# Altium project TestBoard.PrjPcb
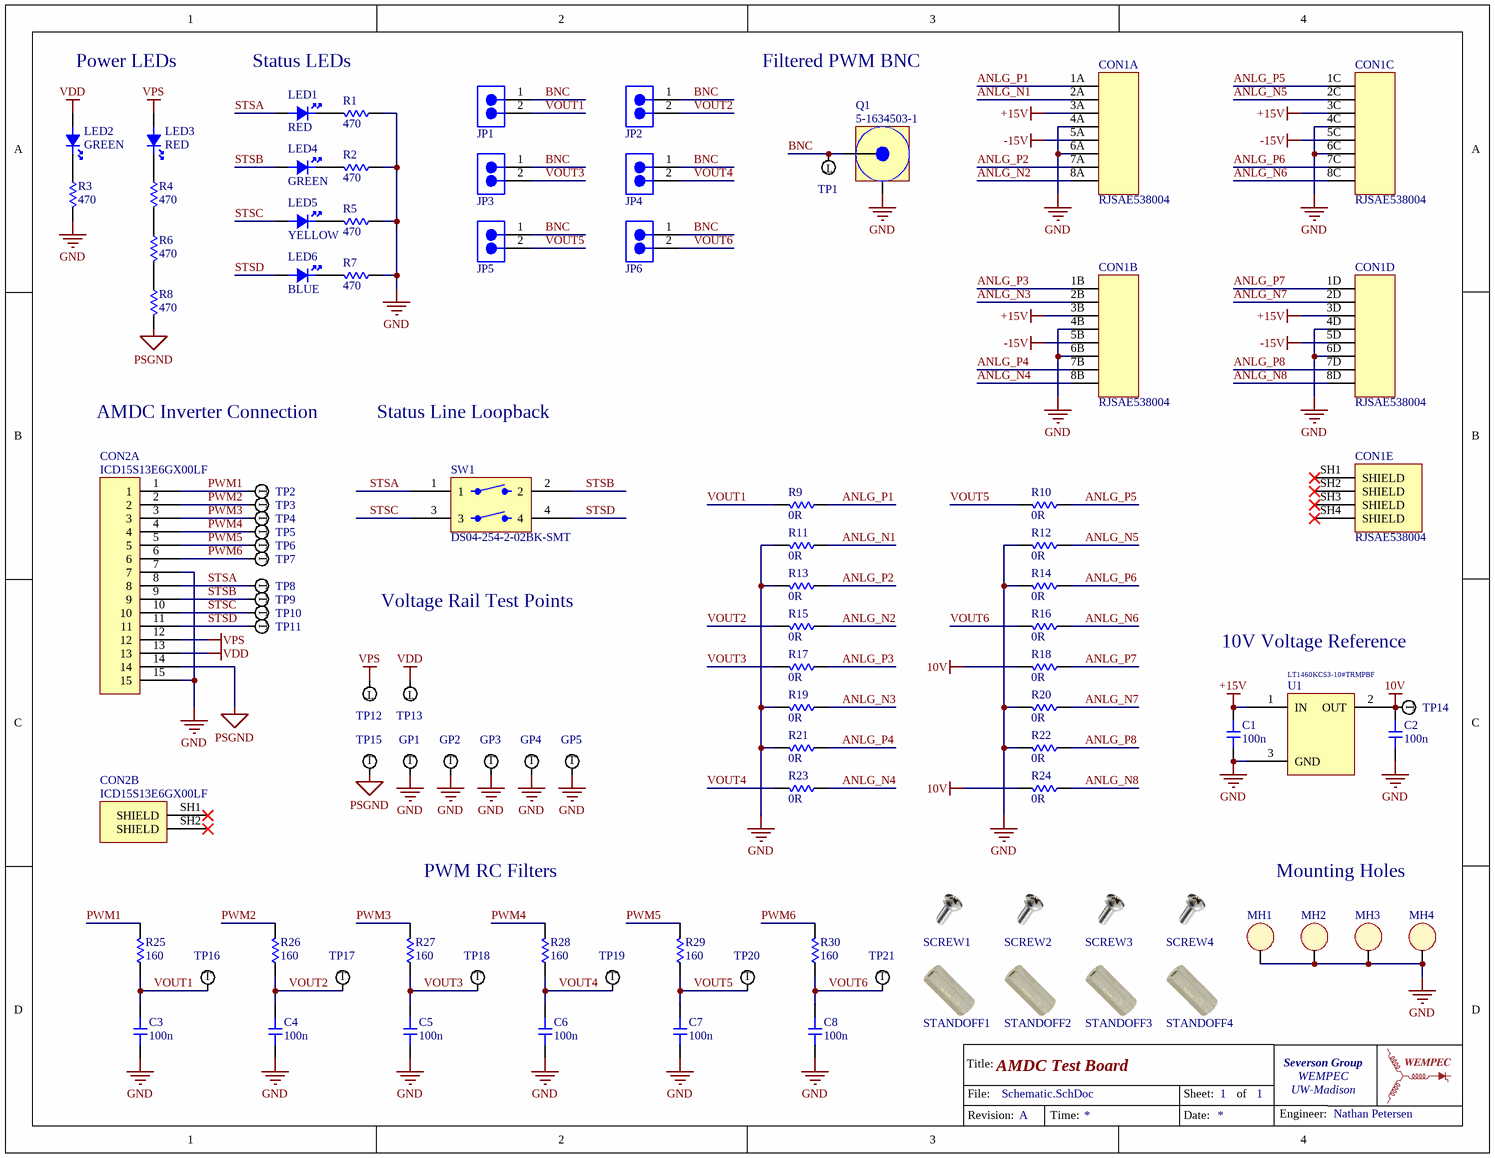
[diagram p0: Schematic.SchDoc]
ProjectGroup: Severson Group; ProjectOrganization: WEMPEC; ProjectRev: A; ProjectUniversity: UW-Madison
1 sheet, 94 parts. Net scope: global (net labels, ports and power ports of the same name join across sheets).
Board file: PCB.PcbDoc

## Sheet Schematic.SchDoc: AMDC Test Board
size Letter; Engineer: Nathan Petersen; SheetNumber: 1; SheetTotal: 1

### Parts
C1  value 100n  [0603-CAP]  (hidden comment: Capacitor)
C2  value 100n  [0603-CAP]  (hidden comment: Capacitor)
C3  value 100n  [0603-CAP]  (hidden comment: Capacitor)
C4  value 100n  [0603-CAP]  (hidden comment: Capacitor)
C5  value 100n  [0603-CAP]  (hidden comment: Capacitor)
C6  value 100n  [0603-CAP]  (hidden comment: Capacitor)
C7  value 100n  [0603-CAP]  (hidden comment: Capacitor)
C8  value 100n  [0603-CAP]  (hidden comment: Capacitor)
CON1  RJSAE538004  [RJSAE538004]  (parts A,B,C,D,E of 5)
CON2  ICD15S13E6GX00LF  [ICD15S13E6GX00LF]  (parts A,B of 2)
GP1  Test Point  [TP_1.6MM]  (value not drawn)
GP2  Test Point  [TP_1.6MM]  (value not drawn)
GP3  Test Point  [TP_1.6MM]  (value not drawn)
GP4  Test Point  [TP_1.6MM]  (value not drawn)
GP5  Test Point  [TP_1.6MM]  (value not drawn)
JP1  Jumper2  [PIN_HEADER_1x2]  (value not drawn)
JP2  Jumper2  [PIN_HEADER_1x2]  (value not drawn)
JP3  Jumper2  [PIN_HEADER_1x2]  (value not drawn)
JP4  Jumper2  [PIN_HEADER_1x2]  (value not drawn)
JP5  Jumper2  [PIN_HEADER_1x2]  (value not drawn)
JP6  Jumper2  [PIN_HEADER_1x2]  (value not drawn)
LED1  value RED  [0603-LED]  (hidden comment: LED)
LED2  value GREEN  [0603-LED]  (hidden comment: LED)
LED3  value RED  [0603-LED]  (hidden comment: LED)
LED4  value GREEN  [0603-LED]  (hidden comment: LED)
LED5  value YELLOW  [0603-LED]  (hidden comment: LED)
LED6  value BLUE  [0603-LED]  (hidden comment: LED)
MH1  MOUNT_HOLE  [MOUNTING_HOLE]  (value not drawn)  (no BOM)
MH2  MOUNT_HOLE  [MOUNTING_HOLE]  (value not drawn)  (no BOM)
MH3  MOUNT_HOLE  [MOUNTING_HOLE]  (value not drawn)  (no BOM)
MH4  MOUNT_HOLE  [MOUNTING_HOLE]  (value not drawn)  (no BOM)
Q1  5-1634503-1  [5-1634503-1]
R1  value 470  [0603-RES]  (hidden comment: Resistor)
R2  value 470  [0603-RES]  (hidden comment: Resistor)
R3  value 470  [0603-RES]  (hidden comment: Resistor)
R4  value 470  [0603-RES]  (hidden comment: Resistor)
R5  value 470  [0603-RES]  (hidden comment: Resistor)
R6  value 470  [0603-RES]  (hidden comment: Resistor)
R7  value 470  [0603-RES]  (hidden comment: Resistor)
R8  value 470  [0603-RES]  (hidden comment: Resistor)
R9  value 0R  [0603-RES]  (hidden comment: Resistor)
R10  value 0R  [0603-RES]  (hidden comment: Resistor)
R11  value 0R  [0603-RES]  (hidden comment: Resistor)
R12  value 0R  [0603-RES]  (hidden comment: Resistor)
R13  value 0R  [0603-RES]  (hidden comment: Resistor)
R14  value 0R  [0603-RES]  (hidden comment: Resistor)
R15  value 0R  [0603-RES]  (hidden comment: Resistor)
R16  value 0R  [0603-RES]  (hidden comment: Resistor)
R17  value 0R  [0603-RES]  (hidden comment: Resistor)
R18  value 0R  [0603-RES]  (hidden comment: Resistor)
R19  value 0R  [0603-RES]  (hidden comment: Resistor)
R20  value 0R  [0603-RES]  (hidden comment: Resistor)
R21  value 0R  [0603-RES]  (hidden comment: Resistor)
R22  value 0R  [0603-RES]  (hidden comment: Resistor)
R23  value 0R  [0603-RES]  (hidden comment: Resistor)
R24  value 0R  [0603-RES]  (hidden comment: Resistor)
R25  value 160  [0603-RES]  (hidden comment: Resistor)
R26  value 160  [0603-RES]  (hidden comment: Resistor)
R27  value 160  [0603-RES]  (hidden comment: Resistor)
R28  value 160  [0603-RES]  (hidden comment: Resistor)
R29  value 160  [0603-RES]  (hidden comment: Resistor)
R30  value 160  [0603-RES]  (hidden comment: Resistor)
SCREW1  Screw-4-40  (value not drawn)  (mechanical)
SCREW2  Screw-4-40  (value not drawn)  (mechanical)
SCREW3  Screw-4-40  (value not drawn)  (mechanical)
SCREW4  Screw-4-40  (value not drawn)  (mechanical)
STANDOFF1  Standoff-4-40  (value not drawn)  (mechanical)
STANDOFF2  Standoff-4-40  (value not drawn)  (mechanical)
STANDOFF3  Standoff-4-40  (value not drawn)  (mechanical)
STANDOFF4  Standoff-4-40  (value not drawn)  (mechanical)
SW1  DS04-254-2-02BK-SMT  [DS04-254-2-02BK-SMT]
TITLE?  TitleBlockWEMPEC  (value not drawn)  (graphical)
TP1  Test Point  [TP_1.6MM]  (value not drawn)
TP2  Test Point  [TP_1.6MM]  (value not drawn)
TP3  Test Point  [TP_1.6MM]  (value not drawn)
TP4  Test Point  [TP_1.6MM]  (value not drawn)
TP5  Test Point  [TP_1.6MM]  (value not drawn)
TP6  Test Point  [TP_1.6MM]  (value not drawn)
TP7  Test Point  [TP_1.6MM]  (value not drawn)
TP8  Test Point  [TP_1.6MM]  (value not drawn)
TP9  Test Point  [TP_1.6MM]  (value not drawn)
TP10  Test Point  [TP_1.6MM]  (value not drawn)
TP11  Test Point  [TP_1.6MM]  (value not drawn)
TP12  Test Point  [TP_1.6MM]  (value not drawn)
TP13  Test Point  [TP_1.6MM]  (value not drawn)
TP14  Test Point  [TP_1.6MM]  (value not drawn)
TP15  Test Point  [TP_1.6MM]  (value not drawn)
TP16  Test Point  [TP_1.6MM]  (value not drawn)
TP17  Test Point  [TP_1.6MM]  (value not drawn)
TP18  Test Point  [TP_1.6MM]  (value not drawn)
TP19  Test Point  [TP_1.6MM]  (value not drawn)
TP20  Test Point  [TP_1.6MM]  (value not drawn)
TP21  Test Point  [TP_1.6MM]  (value not drawn)
U1  LT1460KCS3-10#TRMPBF  [SOT95P237X112-3N]

### Nets
10V: C2.1 R18.2 R24.2 TP14.1 U1.2(OUT)
+15V: C1.1 CON1.3A CON1.3B CON1.3C CON1.3D U1.1(IN)
-15V: CON1.5A CON1.5B CON1.5C CON1.5D
GND: C1.2 C2.2 C3.2 C4.2 C5.2 C6.2 C7.2 C8.2 CON1.4A CON1.4B CON1.4C CON1.4D CON1.6A CON1.6B CON1.6C CON1.6D CON2.7 CON2.15 GP1.1 GP2.1 GP3.1 GP4.1 GP5.1 MH1.1 MH2.1 MH3.1 MH4.1 Q1.2 R1.1 R2.1 R3.2 R5.1 R7.1 R11.2 R12.2 R13.2 R14.2 R19.2 R20.2 R21.2 R22.2 U1.3(GND)
PSGND: CON2.14 R8.2 TP15.1
VDD: CON2.13 LED2.A TP13.1
VPS: CON2.12 LED3.A TP12.1
ANLG_N1: CON1.2A R11.1
ANLG_N2: CON1.8A R15.1
ANLG_N3: CON1.2B R19.1
ANLG_N4: CON1.8B R23.1
ANLG_N5: CON1.2C R12.1
ANLG_N6: CON1.8C R16.1
ANLG_N7: CON1.2D R20.1
ANLG_N8: CON1.8D R24.1
ANLG_P1: CON1.1A R9.1
ANLG_P2: CON1.7A R13.1
ANLG_P3: CON1.1B R17.1
ANLG_P4: CON1.7B R21.1
ANLG_P5: CON1.1C R10.1
ANLG_P6: CON1.7C R14.1
ANLG_P7: CON1.1D R18.1
ANLG_P8: CON1.7D R22.1
BNC: JP1.1 JP2.1 JP3.1 JP4.1 JP5.1 JP6.1 Q1.1 TP1.1
PWM1: CON2.1 R25.2 TP2.1
PWM2: CON2.2 R26.2 TP3.1
PWM3: CON2.3 R27.2 TP4.1
PWM4: CON2.4 R28.2 TP5.1
PWM5: CON2.5 R29.2 TP6.1
PWM6: CON2.6 R30.2 TP7.1
STSA: CON2.8 LED1.A SW1.1 TP8.1
STSB: CON2.9 LED4.A SW1.2 TP9.1
STSC: CON2.10 LED5.A SW1.3 TP10.1
STSD: CON2.11 LED6.A SW1.4 TP11.1
VOUT1: C3.1 JP1.2 R9.2 R25.1 TP16.1
VOUT2: C4.1 JP2.2 R15.2 R26.1 TP17.1
VOUT3: C5.1 JP3.2 R17.2 R27.1 TP18.1
VOUT4: C6.1 JP4.2 R23.2 R28.1 TP19.1
VOUT5: C7.1 JP5.2 R10.2 R29.1 TP20.1
VOUT6: C8.1 JP6.2 R16.2 R30.1 TP21.1
NetLED1_C: LED1.C R1.2
NetLED2_C: LED2.C R3.1
NetLED3_C: LED3.C R4.1
NetLED4_C: LED4.C R2.2
NetLED5_C: LED5.C R5.2
NetLED6_C: LED6.C R7.2
NetR4_2: R4.2 R6.1
NetR6_2: R6.2 R8.1

Not connected (* = marked no-connect by the designer): CON1 SH1(SHIELD)* SH2(SHIELD)* SH3(SHIELD)* SH4(SHIELD)*; CON2 SH1(SHIELD)* SH2(SHIELD)*

### Notes on the sheet
- Power LEDs
- Status LEDs
- Filtered PWM BNC
- AMDC Inverter Connection
- Status Line Loopback
- Voltage Rail Test Points
- 10V Voltage Reference
- PWM RC Filters
- Mounting Holes
- (in symbol Test Point) T
- (in symbol TitleBlockWEMPEC) Title:; File:; Sheet:; of; Engineer:; Revision:; Time:; Date:

### Library data of the parts
CON1 = RJSAE538004: CONN MOD JACK 8P8C R/A SHIELDED; Supplier 1: Digi-Key; Supplier Part Number 1: RJSAE538004-ND
CON2 = ICD15S13E6GX00LF: CONN DSUB HD RCPT 15POS R/A SLDR; Supplier Part Number 1: 609-2801-ND; Supplier 1: Digi-Key
MH1-MH4 = MOUNT_HOLE: MOUNTING HOLE
Q1 = 5-1634503-1: CONN BNC JACK STR 50 OHM PCB; Supplier 1: Digi-Key; Supplier Part Number 1: A97581-ND
SW1 = DS04-254-2-02BK-SMT: DIP SWITCH, SPST, 2.54 PITCH, FL; Supplier Part Number 1: 2223-DS04-254-2-02BK-SMT-ND; Supplier 1: Digi-Key
U1 = LT1460KCS3-10#TRMPBF: IC VREF SERIES 0.5% SOT23-3; Supplier 1: Digi-Key; Supplier Part Number 1: LT1460KCS3-10#TRMPBFCT-ND
C1-C8 = Capacitor: Supplier 1: Digi-Key; Supplier Part Number 1: 311-1341-1-ND
GP1-GP5 TP1-TP21 = Test Point: Supplier 1: Digi-Key; Supplier Part Number 1: 36-5005-ND
JP1-JP6 = Jumper2: Supplier 1: Digi-Key; Supplier Part Number 1: 732-5315-ND
LED1-LED6 = LED: Supplier 1: Digi-Key
  LED1 LED3: Supplier Part Number 1: 732-4978-1-ND
  LED2 LED4: Supplier Part Number 1: 732-4980-1-ND
  LED5: Supplier Part Number 1: 732-4981-1-ND
  LED6: Supplier Part Number 1: 732-4966-1-ND
R1-R30 = Resistor: Supplier 1: Digi-Key
  R1-R8: Supplier Part Number 1: 311-470GRCT-ND
  R9-R24: Supplier Part Number 1: 311-0.0GRCT-ND
  R25-R30: Supplier Part Number 1: 311-160HRCT-ND
SCREW1-SCREW4 = Screw-4-40: Supplier 1: Digi-Key; Supplier Part Number 1: KEY1046-ND
STANDOFF1-STANDOFF4 = Standoff-4-40: Supplier 1: Digi-Key; Supplier Part Number 1: 36-1656-ND